# Altium schematic sheet 09_EXP_CN_100PIN.SchDoc
size A2; ApprovedBy: DNP; CheckedBy: DNP; Author: DNP; CompanyName: Google LLC; DrawnBy: DNP; Engineer: Bangfei/Michael/Leo; Organization: Google LLC; Address1: 1600 Amphitheatre Parkway; Address2: Mountain View, CA 94043; Address3: DNP; Address4: DNP; DocumentNumber: DNP; Revision: PVT; SheetNumber: 9; SheetTotal: 11; VersionControl_RevNumber: DNP; IsUserConfigurable: DNP; Time: DNP; ImagePath: DNP; Rule: DNP; ProjectName: Enterprise; Application_BuildNumber: DNP
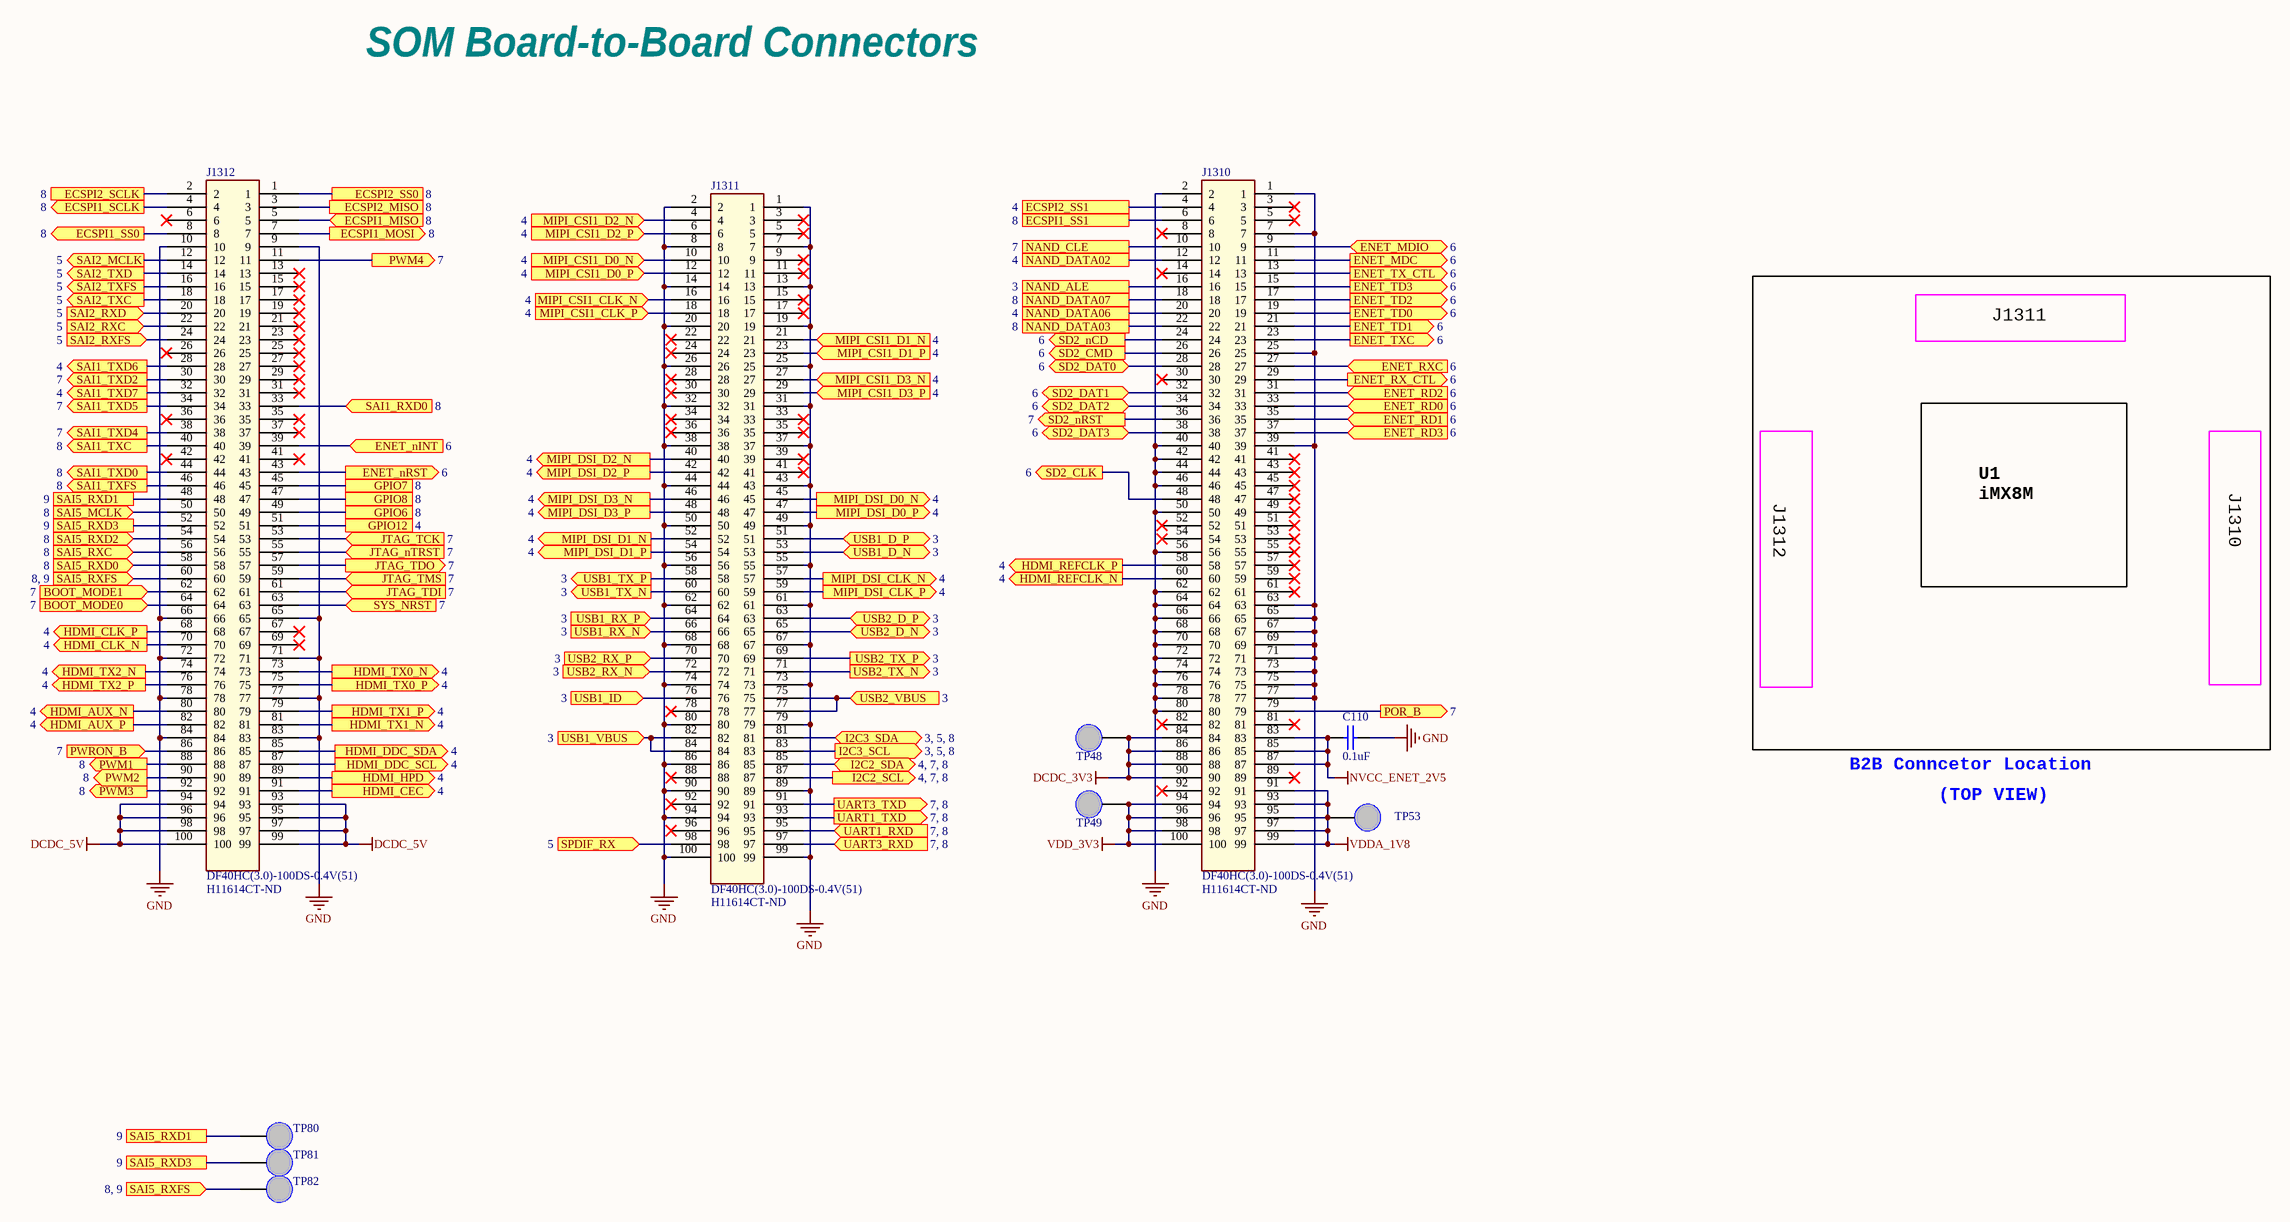
[diagram p0: 09_EXP_CN_100PIN.SchDoc]

## Parts
C110  value 0.1uF  [0201]  (hidden comment: 0.1uF/10V)
J1310  DF40HC(3.0)-100DS-0.4V(51)  Supplier Part Number 1: H11614CT-ND  [DF40HC-3_0-100DS-0_4V-51]
J1311  DF40HC(3.0)-100DS-0.4V(51)  Supplier Part Number 1: H11614CT-ND  [DF40HC-3_0-100DS-0_4V-51]
J1312  DF40HC(3.0)-100DS-0.4V(51)  Supplier Part Number 1: H11614CT-ND  [DF40HC-3_0-100DS-0_4V-51]
TP48  TP NM  [TP_SMD_L]  (value not drawn)  (no BOM)
TP49  TP NM  [TP_SMD_L]  (value not drawn)  (no BOM)
TP53  TP NM  [TP_SMD_L]  (value not drawn)  (no BOM)
TP80  TP NM  [TP_SMD_L]  (value not drawn)  (no BOM)
TP81  TP NM  [TP_SMD_L]  (value not drawn)  (no BOM)
TP82  TP NM  [TP_SMD_L]  (value not drawn)  (no BOM)

## Ports
BOOT_MODE0 (in, see 7), BOOT_MODE1 (in, see 7), ECSPI1_MISO (in, see 8), ECSPI1_MOSI (out, see 8), ECSPI1_SCLK (out, see 8), ECSPI1_SS0 (out, see 8), ECSPI1_SS1 (see 8), ECSPI2_MISO (see 8), ECSPI2_SCLK (see 8), ECSPI2_SS0 (see 8), ECSPI2_SS1 (see 4), ENET_MDC (out, see 6), ENET_MDIO (bidir, see 6), ENET_nINT (in, see 6), ENET_nRST (out, see 6), ENET_RD0 (in, see 6), ENET_RD1 (in, see 6), ENET_RD2 (in, see 6), ENET_RD3 (in, see 6), ENET_RX_CTL (out, see 6), ENET_RXC (in, see 6), ENET_TD0 (out, see 6), ENET_TD1 (out, see 6), ENET_TD2 (out, see 6), ENET_TD3 (out, see 6), ENET_TX_CTL (out, see 6), ENET_TXC (out, see 6), GPIO6 (see 8), GPIO7 (see 8), GPIO8 (see 8), GPIO12 (see 4), HDMI_AUX_N (out, see 4), HDMI_AUX_P (out, see 4), HDMI_CEC (out, see 4), HDMI_CLK_N (out, see 4), HDMI_CLK_P (out, see 4), HDMI_DDC_SCL (out, see 4), HDMI_DDC_SDA (out, see 4), HDMI_HPD (out, see 4), HDMI_REFCLK_N (out, see 4), HDMI_REFCLK_P (out, see 4), HDMI_TX0_N (out, see 4), HDMI_TX0_P (out, see 4), HDMI_TX1_N (out, see 4), HDMI_TX1_P (out, see 4), HDMI_TX2_N (out, see 4), HDMI_TX2_P (out, see 4), I2C2_SCL (out, see 4, 7, 8), I2C2_SDA (bidir, see 4, 7, 8), I2C3_SCL (out, see 3, 5, 8), I2C3_SDA (bidir, see 3, 5, 8), JTAG_nTRST (in, see 7), JTAG_TCK (in, see 7), JTAG_TDI (in, see 7), JTAG_TDO (out, see 7), JTAG_TMS (in, see 7), MIPI_CSI1_CLK_N (in, see 4), MIPI_CSI1_CLK_P (in, see 4), MIPI_CSI1_D0_N (in, see 4), MIPI_CSI1_D0_P (in, see 4), MIPI_CSI1_D1_N (in, see 4), MIPI_CSI1_D1_P (in, see 4), MIPI_CSI1_D2_N (in, see 4), MIPI_CSI1_D2_P (in, see 4), MIPI_CSI1_D3_N (in, see 4), MIPI_CSI1_D3_P (in, see 4), MIPI_DSI_CLK_N (out, see 4), MIPI_DSI_CLK_P (out, see 4), MIPI_DSI_D0_N (out, see 4), MIPI_DSI_D0_P (out, see 4), MIPI_DSI_D1_N (out, see 4), MIPI_DSI_D1_P (out, see 4), MIPI_DSI_D2_N (out, see 4), MIPI_DSI_D2_P (out, see 4), MIPI_DSI_D3_N (out, see 4), MIPI_DSI_D3_P (out, see 4), NAND_ALE (see 3), NAND_CLE (see 7), NAND_DATA02 (see 4), NAND_DATA03 (see 8), NAND_DATA06 (see 4), NAND_DATA07 (see 8), POR_B (out, see 7), PWM1 (out, see 8), PWM2 (out, see 8), PWM3 (out, see 8), PWM4 (out, see 7), PWRON_B (in, see 7), SAI1_RXD0 (in, see 8), SAI1_TXC (out, see 8), SAI1_TXD0 (out, see 8), SAI1_TXD2 (out, see 7), SAI1_TXD4 (out, see 7), SAI1_TXD5 (out, see 7), SAI1_TXD6 (out, see 4), SAI1_TXD7 (out, see 4), SAI1_TXFS (out, see 8), SAI2_MCLK (out, see 5), SAI2_RXC (in, see 5), SAI2_RXD (in, see 5), SAI2_RXFS (in, see 5), SAI2_TXC (out, see 5), SAI2_TXD (out, see 5), SAI2_TXFS (out, see 5), SAI5_MCLK (in, see 8), SAI5_RXC (in, see 8), SAI5_RXD0 (in, see 8), SAI5_RXD1 (see 9), SAI5_RXD2 (in, see 8), SAI5_RXD3 (see 9), SAI5_RXFS (in, see 8, 9), SD2_CLK (out, see 6), SD2_CMD (out, see 6), SD2_DAT0 (bidir, see 6), SD2_DAT1 (bidir, see 6), SD2_DAT2 (bidir, see 6), SD2_DAT3 (bidir, see 6), SD2_nCD (out, see 6), SD2_nRST (out, see 7), SPDIF_RX (in, see 5), SYS_NRST (in, see 7), UART1_RXD (in, see 7, 8), UART1_TXD (out, see 7, 8), UART3_RXD (in, see 7, 8), UART3_TXD (out, see 7, 8), USB1_D_N (bidir, see 3), USB1_D_P (bidir, see 3), USB1_ID (in, see 3), USB1_RX_N (in, see 3), USB1_RX_P (in, see 3), USB1_TX_N (out, see 3), USB1_TX_P (out, see 3), USB1_VBUS (in, see 3), USB2_D_N (bidir, see 3), USB2_D_P (bidir, see 3), USB2_RX_N (in, see 3), USB2_RX_P (in, see 3), USB2_TX_N (out, see 3), USB2_TX_P (out, see 3), USB2_VBUS (in, see 3)

## Nets
DCDC_3V3: J1310.84 J1310.86 J1310.88 J1310.90 TP48.1
DCDC_5V: J1312.93 J1312.94 J1312.95 J1312.96 J1312.97 J1312.98 J1312.99 J1312.100
GND: C110.2 J1310.1 J1310.2 J1310.7 J1310.25 J1310.39 J1310.40 J1310.42 J1310.44 J1310.46 J1310.50 J1310.56 J1310.62 J1310.63 J1310.64 J1310.65 J1310.66 J1310.67 J1310.68 J1310.69 J1310.70 J1310.71 J1310.72 J1310.73 J1310.74 J1310.75 J1310.76 J1310.77 J1310.78 J1310.80 J1311.1 J1311.2 J1311.7 J1311.8 J1311.13 J1311.14 J1311.19 J1311.20 J1311.25 J1311.26 J1311.31 J1311.32 J1311.37 J1311.38 J1311.43 J1311.44 J1311.49 J1311.50 J1311.55 J1311.56 J1311.61 J1311.62 J1311.67 J1311.68 J1311.73 J1311.74 J1311.79 J1311.80 J1311.86 J1311.89 J1311.90 J1311.94 J1311.99 J1311.100 J1312.9 J1312.10 J1312.65 J1312.66 J1312.71 J1312.72 J1312.77 J1312.78 J1312.83 J1312.84
NVCC_ENET_2V5: C110.1 J1310.83 J1310.85 J1310.87
VDD_3V3: J1310.94 J1310.96 J1310.98 J1310.100 TP49.1
VDDA_1V8: J1310.91 J1310.93 J1310.95 J1310.97 J1310.99 TP53.1
BOOT_MODE0: J1312.64 ; port BOOT_MODE0
BOOT_MODE1: J1312.62 ; port BOOT_MODE1
ECSPI1_MISO: J1312.5 ; port ECSPI1_MISO
ECSPI1_MOSI: J1312.7 ; port ECSPI1_MOSI
ECSPI1_SCLK: J1312.4 ; port ECSPI1_SCLK
ECSPI1_SS0: J1312.8 ; port ECSPI1_SS0
ECSPI1_SS1: J1310.6 ; port ECSPI1_SS1
ECSPI2_MISO: J1312.3 ; port ECSPI2_MISO
ECSPI2_SCLK: J1312.2 ; port ECSPI2_SCLK
ECSPI2_SS0: J1312.1 ; port ECSPI2_SS0
ECSPI2_SS1: J1310.4 ; port ECSPI2_SS1
ENET_MDC: J1310.11 ; port ENET_MDC
ENET_MDIO: J1310.9 ; port ENET_MDIO
ENET_nINT: J1312.39 ; port ENET_nINT
ENET_nRST: J1312.43 ; port ENET_nRST
ENET_RD0: J1310.33 ; port ENET_RD0
ENET_RD1: J1310.35 ; port ENET_RD1
ENET_RD2: J1310.31 ; port ENET_RD2
ENET_RD3: J1310.37 ; port ENET_RD3
ENET_RX_CTL: J1310.29 ; port ENET_RX_CTL
ENET_RXC: J1310.27 ; port ENET_RXC
ENET_TD0: J1310.19 ; port ENET_TD0
ENET_TD1: J1310.21 ; port ENET_TD1
ENET_TD2: J1310.17 ; port ENET_TD2
ENET_TD3: J1310.15 ; port ENET_TD3
ENET_TX_CTL: J1310.13 ; port ENET_TX_CTL
ENET_TXC: J1310.23 ; port ENET_TXC
GPIO6: J1312.49 ; port GPIO6
GPIO7: J1312.45 ; port GPIO7
GPIO8: J1312.47 ; port GPIO8
GPIO12: J1312.51 ; port GPIO12
HDMI_AUX_N: J1312.80 ; port HDMI_AUX_N
HDMI_AUX_P: J1312.82 ; port HDMI_AUX_P
HDMI_CEC: J1312.91 ; port HDMI_CEC
HDMI_CLK_N: J1312.70 ; port HDMI_CLK_N
HDMI_CLK_P: J1312.68 ; port HDMI_CLK_P
HDMI_DDC_SCL: J1312.87 ; port HDMI_DDC_SCL
HDMI_DDC_SDA: J1312.85 ; port HDMI_DDC_SDA
HDMI_HPD: J1312.89 ; port HDMI_HPD
HDMI_REFCLK_N: J1310.60 ; port HDMI_REFCLK_N
HDMI_REFCLK_P: J1310.58 ; port HDMI_REFCLK_P
HDMI_TX0_N: J1312.73 ; port HDMI_TX0_N
HDMI_TX0_P: J1312.75 ; port HDMI_TX0_P
HDMI_TX1_N: J1312.81 ; port HDMI_TX1_N
HDMI_TX1_P: J1312.79 ; port HDMI_TX1_P
HDMI_TX2_N: J1312.74 ; port HDMI_TX2_N
HDMI_TX2_P: J1312.76 ; port HDMI_TX2_P
I2C2_SCL: J1311.87 ; port I2C2_SCL
I2C2_SDA: J1311.85 ; port I2C2_SDA
I2C3_SCL: J1311.83 ; port I2C3_SCL
I2C3_SDA: J1311.81 ; port I2C3_SDA
JTAG_nTRST: J1312.55 ; port JTAG_nTRST
JTAG_TCK: J1312.53 ; port JTAG_TCK
JTAG_TDI: J1312.61 ; port JTAG_TDI
JTAG_TDO: J1312.57 ; port JTAG_TDO
JTAG_TMS: J1312.59 ; port JTAG_TMS
MIPI_CSI1_CLK_N: J1311.16 ; port MIPI_CSI1_CLK_N
MIPI_CSI1_CLK_P: J1311.18 ; port MIPI_CSI1_CLK_P
MIPI_CSI1_D0_N: J1311.10 ; port MIPI_CSI1_D0_N
MIPI_CSI1_D0_P: J1311.12 ; port MIPI_CSI1_D0_P
MIPI_CSI1_D1_N: J1311.21 ; port MIPI_CSI1_D1_N
MIPI_CSI1_D1_P: J1311.23 ; port MIPI_CSI1_D1_P
MIPI_CSI1_D2_N: J1311.4 ; port MIPI_CSI1_D2_N
MIPI_CSI1_D2_P: J1311.6 ; port MIPI_CSI1_D2_P
MIPI_CSI1_D3_N: J1311.27 ; port MIPI_CSI1_D3_N
MIPI_CSI1_D3_P: J1311.29 ; port MIPI_CSI1_D3_P
MIPI_DSI_CLK_N: J1311.57 ; port MIPI_DSI_CLK_N
MIPI_DSI_CLK_P: J1311.59 ; port MIPI_DSI_CLK_P
MIPI_DSI_D0_N: J1311.45 ; port MIPI_DSI_D0_N
MIPI_DSI_D0_P: J1311.47 ; port MIPI_DSI_D0_P
MIPI_DSI_D1_N: J1311.52 ; port MIPI_DSI_D1_N
MIPI_DSI_D1_P: J1311.54 ; port MIPI_DSI_D1_P
MIPI_DSI_D2_N: J1311.40 ; port MIPI_DSI_D2_N
MIPI_DSI_D2_P: J1311.42 ; port MIPI_DSI_D2_P
MIPI_DSI_D3_N: J1311.46 ; port MIPI_DSI_D3_N
MIPI_DSI_D3_P: J1311.48 ; port MIPI_DSI_D3_P
NAND_ALE: J1310.16 ; port NAND_ALE
NAND_CLE: J1310.10 ; port NAND_CLE
NAND_DATA02: J1310.12 ; port NAND_DATA02
NAND_DATA03: J1310.22 ; port NAND_DATA03
NAND_DATA06: J1310.20 ; port NAND_DATA06
NAND_DATA07: J1310.18 ; port NAND_DATA07
POR_B: J1310.79 ; port POR_B
PWM1: J1312.88 ; port PWM1
PWM2: J1312.90 ; port PWM2
PWM3: J1312.92 ; port PWM3
PWM4: J1312.11 ; port PWM4
PWRON_B: J1312.86 ; port PWRON_B
SAI1_RXD0: J1312.33 ; port SAI1_RXD0
SAI1_TXC: J1312.40 ; port SAI1_TXC
SAI1_TXD0: J1312.44 ; port SAI1_TXD0
SAI1_TXD2: J1312.30 ; port SAI1_TXD2
SAI1_TXD4: J1312.38 ; port SAI1_TXD4
SAI1_TXD5: J1312.34 ; port SAI1_TXD5
SAI1_TXD6: J1312.28 ; port SAI1_TXD6
SAI1_TXD7: J1312.32 ; port SAI1_TXD7
SAI1_TXFS: J1312.46 ; port SAI1_TXFS
SAI2_MCLK: J1312.12 ; port SAI2_MCLK
SAI2_RXC: J1312.22 ; port SAI2_RXC
SAI2_RXD: J1312.20 ; port SAI2_RXD
SAI2_RXFS: J1312.24 ; port SAI2_RXFS
SAI2_TXC: J1312.18 ; port SAI2_TXC
SAI2_TXD: J1312.14 ; port SAI2_TXD
SAI2_TXFS: J1312.16 ; port SAI2_TXFS
SAI5_MCLK: J1312.50 ; port SAI5_MCLK
SAI5_RXC: J1312.56 ; port SAI5_RXC
SAI5_RXD0: J1312.58 ; port SAI5_RXD0
SAI5_RXD1: J1312.48 TP80.1 ; port SAI5_RXD1
SAI5_RXD2: J1312.54 ; port SAI5_RXD2
SAI5_RXD3: J1312.52 TP81.1 ; port SAI5_RXD3
SAI5_RXFS: J1312.60 TP82.1 ; port SAI5_RXFS
SD2_CLK: J1310.48 ; port SD2_CLK
SD2_CMD: J1310.26 ; port SD2_CMD
SD2_DAT0: J1310.28 ; port SD2_DAT0
SD2_DAT1: J1310.32 ; port SD2_DAT1
SD2_DAT2: J1310.34 ; port SD2_DAT2
SD2_DAT3: J1310.38 ; port SD2_DAT3
SD2_nCD: J1310.24 ; port SD2_nCD
SD2_nRST: J1310.36 ; port SD2_nRST
SPDIF_RX: J1311.98 ; port SPDIF_RX
SYS_NRST: J1312.63 ; port SYS_NRST
UART1_RXD: J1311.95 ; port UART1_RXD
UART1_TXD: J1311.93 ; port UART1_TXD
UART3_RXD: J1311.97 ; port UART3_RXD
UART3_TXD: J1311.91 ; port UART3_TXD
USB1_D_N: J1311.53 ; port USB1_D_N
USB1_D_P: J1311.51 ; port USB1_D_P
USB1_ID: J1311.76 ; port USB1_ID
USB1_RX_N: J1311.66 ; port USB1_RX_N
USB1_RX_P: J1311.64 ; port USB1_RX_P
USB1_TX_N: J1311.60 ; port USB1_TX_N
USB1_TX_P: J1311.58 ; port USB1_TX_P
USB1_VBUS: J1311.82 J1311.84 ; port USB1_VBUS
USB2_D_N: J1311.65 ; port USB2_D_N
USB2_D_P: J1311.63 ; port USB2_D_P
USB2_RX_N: J1311.72 ; port USB2_RX_N
USB2_RX_P: J1311.70 ; port USB2_RX_P
USB2_TX_N: J1311.71 ; port USB2_TX_N
USB2_TX_P: J1311.69 ; port USB2_TX_P
USB2_VBUS: J1311.75 J1311.77 ; port USB2_VBUS

Not connected (* = marked no-connect by the designer): J1310 3* 5* 8* 14* 30* 41* 43* 45* 47* 49* 51* 52* 53* 54* 55* 57* 59* 61* 81* 82* 89* 92*; J1311 3* 5* 9* 11* 15* 17* 22* 24* 28* 30* 33* 34* 35* 36* 39* 41* 78* 88* 92* 96*; J1312 6* 13* 15* 17* 19* 21* 23* 25* 26* 27* 29* 31* 35* 36* 37* 41* 42* 67* 69*

## Notes on the sheet
- SOM Board-to-Board Connectors
- J1311
- J1312
- U1
  iMX8M
- J1310
- B2B Conncetor Location
- (TOP VIEW)
- Project:
- Engineer:
- Date:
- File:
- Revision:
- Sheet
- of

## Library data of the parts
C110 = CAP_0201_0.1uF: CAP CER 0.1UF 10V 10% X5R 0201; MPN: C0603X5R1A104K030BC; QCI MPN: GRM033R61A104K; QPN: CH4102K9E00; QPN Description: CAP CHIP 0.1U 10V(+-10%,X5R,0201); Function Code: DOK; Supplier 1: Digi-Key; Supplier Part Number 1: 445-7318-1-ND; QCI Supplier: MUR
J1310-J1312 = CONN_HIROSE-DF40C-100DP-0.4V(51): CONN HDR 100POS 0.4MM SMD GOLD; Function Code: DOK; QPN: DFHSA0FR017; QPN Description: CONN HOUSING 100P 2R FR(P0.4,H2.9); QCI Supplier: HRS; Supplier 1: Digi-Key; MPN: DF40HC(3.0)-100DS-0.4V(51); QCI MPN: DF40HC(3.0)-100DS-0.4V(51)
TP48 TP49 TP53 TP80-TP82 = TP_L: TEST POINT (Large)